# EAGLE design GD32FxxxR-dev-board (EAGLE 9.6.2)
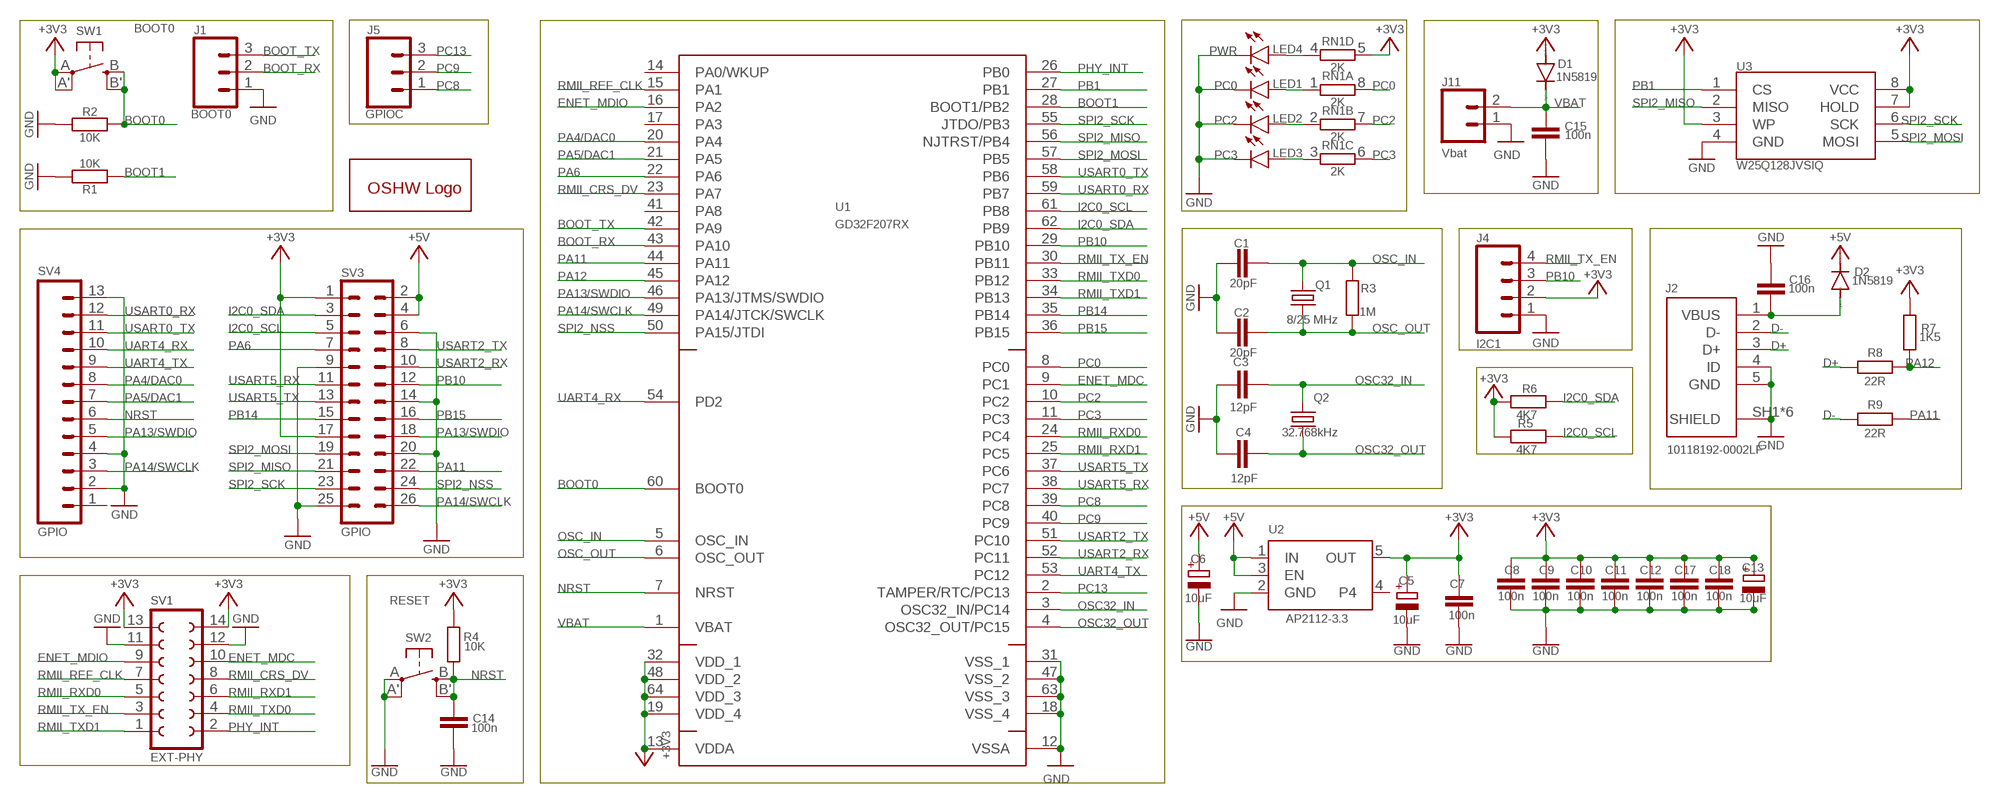
[diagram p0: schematic, sheet 1]

## Parts
C1  20pF  C-EUC0603  [C0603]
C2  20pF  C-EUC0603  [C0603]
C3  12pF  C-EUC0603  [C0603]
C4  12pF  C-EUC0603  [C0603]
C5  10uF  CPOL-EUA/3216-18R  [A/3216-18R]
C6  10uF  CPOL-EUA/3216-18R  [A/3216-18R]
C7  100n  C-EUC0603  [C0603]
C8  100n  C-EUC0603  [C0603]
C9  100n  C-EUC0603  [C0603]
C10  100n  C-EUC0603  [C0603]
C11  100n  C-EUC0603  [C0603]
C12  100n  C-EUC0603  [C0603]
C13  10uF  CPOL-EUA/3216-18R  [A/3216-18R]
C14  100n  C-EUC0603  [C0603]
C15  100n  C-EUC0603  [C0603]
C16  100n  C-EUC0603  [C0603]
C17  100n  C-EUC0603  [C0603]
C18  100n  C-EUC0603  [C0603]
D1  1N5819  DIODE-SOD323-R  [SOD323-R]
D2  1N5819  DIODE-SOD323-R  [SOD323-R]
GOLD_ORB_SM1  OSHWLOGOLOGO5MM  [OSHW_5MM]
J1  BOOT0  CONN_03  [1X03]
J2  10118192-0002LF  [10118192-0002LF]
J4  I2C1  CONN_04  [1X04]
J5  GPIOC  CONN_03  [1X03]
J11  Vbat  CONN_021X02_NO_SILK  [1X02_NO_SILK]
LED1  PC0  LEDCHIP-LED0603  [CHIP-LED0603]
LED2  PC2  LEDCHIP-LED0603  [CHIP-LED0603]
LED3  PC3  LEDCHIP-LED0603  [CHIP-LED0603]
LED4  PWR  LEDCHIP-LED0603  [CHIP-LED0603]
Q1  8/25 MHz  CSM-7X-DU  [CSM-7X-DU]
Q2  32.768kHz  KX-327-NHT  [3.2X1.5]
R1  10K  R-EU_R0603  [R0603]
R2  10K  R-EU_R0603  [R0603]
R3  1M  R-EU_R0603  [R0603]
R4  10K  R-EU_R0603  [R0603]
R5  4K7  R-EU_R0603  [R0603]
R6  4K7  R-EU_R0603  [R0603]
R7  1K5  R-EU_R0603  [R0603]
R8  22R  R-EU_R0603  [R0603]
R9  22R  R-EU_R0603  [R0603]
RN1  2K  4R-N0402ARV341  [4X0402ARV341]
SV1  EXT-PHY  FE07-2W  [FE07-2W]
SV3  GPIO  MA13-2  [MA13-2]
SV4  GPIO  CONN_13  [1X13]
SW1  BOOT0  SPST_TACT-EVQQ2  [EVQ-Q2]
SW2  RESET  SPST_TACT-EVQQ2  [EVQ-Q2]
U1  GD32F207RX  [LQFP64]
U2  AP2112-3.3  VREG_SOT23-5  [SOT23-5]
U3  W25Q128JVSIQ  SPI_FLASH-X25XXSMD1  [SO08-EIAJ]

## Nets
+3V3: C5.+ C7.1 C8.1 C9.1 C10.1 C11.1 C12.1 C13.+ C17.1 C18.1 D1.A J4.2 R4.2 R5.2 R6.2 R7.2 RN1.5 SV1.13 SV1.14 SV3.1 SV3.17 SW1.A'(P1) SW1.A(P) U1.13(VDDA) U1.19(VDD_4) U1.32(VDD_1) U1.48(VDD_2) U1.64(VDD_3) U2.5(OUT) U3.3(WP) U3.7(HOLD) U3.8(VCC)
+5V: C6.+ D2.C SV3.2 SV3.4 U2.1(IN) U2.3(EN)
BOOT0: R2.2 SW1.B'(S1) SW1.B(S) U1.60(BOOT0)
BOOT1: R1.1 U1.28(BOOT1/PB2)
BOOT_RX: J1.2 U1.43(PA10)
BOOT_TX: J1.3 U1.42(PA9)
D+: J2.3(D+) R8.1
D-: J2.2(D-) R9.1
ENET_MDC: SV1.10 U1.9(PC1)
ENET_MDIO: SV1.9 U1.16(PA2)
GND: C1.1 C2.1 C3.1 C4.1 C5.- C6.- C7.2 C8.2 C9.2 C10.2 C11.2 C12.2 C13.- C14.2 C15.2 C16.1 C17.2 C18.2 J1.1 J2.4(ID) J2.5(GND) J2.SH1(SHIELD) J2.SH2(SHIELD) J2.SH3(SHIELD) J2.SH4(SHIELD) J2.SH5(SHIELD) J2.SH6(SHIELD) J4.1 J11.1 LED1.C LED2.C LED3.C LED4.C R1.2 R2.1 SV1.11 SV1.12 SV3.6 SV3.9 SV3.14 SV3.20 SV3.25 SV4.2 SV4.4 SV4.13 SW2.A'(P1) SW2.A(P) U1.12(VSSA) U1.18(VSS_4) U1.31(VSS_1) U1.47(VSS_2) U1.63(VSS_3) U2.2(GND) U3.4(GND)
I2C0_SCL: R5.1 SV3.5 U1.61(PB8)
I2C0_SDA: R6.1 SV3.3 U1.62(PB9)
N$10: LED1.A RN1.1
N$11: LED2.A RN1.2
N$25: LED3.A RN1.3
N$26: LED4.A RN1.4
NRST: C14.1 R4.1 SV4.6 SW2.B'(S1) SW2.B(S) U1.7(NRST)
OSC32_IN: C3.2 Q2.2 U1.3(OSC32_IN/PC14)
OSC32_OUT: C4.2 Q2.1 U1.4(OSC32_OUT/PC15)
OSC_IN: C1.2 Q1.2 R3.1 U1.5(OSC_IN)
OSC_OUT: C2.2 Q1.1 R3.2 U1.6(OSC_OUT)
PA4/DAC0: SV4.8 U1.20(PA4)
PA5/DAC1: SV4.7 U1.21(PA5)
PA6: SV3.7 U1.22(PA6)
PA11: R9.2 SV3.22 U1.44(PA11)
PA12: R7.1 R8.2 U1.45(PA12)
PA13/SWDIO: SV3.18 SV4.5 U1.46(PA13/JTMS/SWDIO)
PA14/SWCLK: SV3.26 SV4.3 U1.49(PA14/JTCK/SWCLK)
PB1: U1.27(PB1) U3.1(CS)
PB10: J4.3 SV3.12 U1.29(PB10)
PB14: SV3.15 U1.35(PB14)
PB15: SV3.16 U1.36(PB15)
PC0: RN1.8 U1.8(PC0)
PC2: RN1.7 U1.10(PC2)
PC3: RN1.6 U1.11(PC3)
PC8: J5.1 U1.39(PC8)
PC9: J5.2 U1.40(PC9)
PC13: J5.3 U1.2(TAMPER/RTC/PC13)
PHY_INT: SV1.2 U1.26(PB0)
RMII_CRS_DV: SV1.8 U1.23(PA7)
RMII_REF_CLK: SV1.7 U1.15(PA1)
RMII_RXD0: SV1.5 U1.24(PC4)
RMII_RXD1: SV1.6 U1.25(PC5)
RMII_TX_EN: J4.4 SV1.3 U1.30(PB11)
RMII_TXD0: SV1.4 U1.33(PB12)
RMII_TXD1: SV1.1 U1.34(PB13)
SPI2_MISO: SV3.21 U1.56(NJTRST/PB4) U3.2(MISO)
SPI2_MOSI: SV3.19 U1.57(PB5) U3.5(MOSI)
SPI2_NSS: SV3.24 U1.50(PA15/JTDI)
SPI2_SCK: SV3.23 U1.55(JTDO/PB3) U3.6(SCK)
UART4_RX: SV4.10 U1.54(PD2)
UART4_TX: SV4.9 U1.53(PC12)
USART0_RX: SV4.12 U1.59(PB7)
USART0_TX: SV4.11 U1.58(PB6)
USART2_RX: SV3.10 U1.52(PC11)
USART2_TX: SV3.8 U1.51(PC10)
USART5_RX: SV3.11 U1.38(PC7)
USART5_TX: SV3.13 U1.37(PC6)
VBAT: C15.1 D1.C J11.2 U1.1(VBAT)
VBUS: C16.2 D2.A J2.1(VBUS)
Unconnected: SV4.1 U1.14(PA0/WKUP) U1.17(PA3) U1.41(PA8) U2.4

## Library data of the parts
C1-C4 = rcl:C-EU: CAPACITOR, European symbol; JLCPCB: C38523; SPICEPREFIX: C
C5 C6 C13 = rcl:CPOL-EU: POLARIZED CAPACITOR, European symbol; JLCPCB: C7171; SPICEPREFIX: C
C7-C12 C14-C18 = rcl:C-EU: CAPACITOR, European symbol; JLCPCB: C14663; SPICEPREFIX: C
D1 D2 = diode:DIODE-: DIODE; JLCPCB: C191023
GOLD_ORB_SM1 = oshw:OSHWLOGO: The OSHW logo for PCB layout
J1 J5 = SparkFun-Connectors:CONN_03: Multi connection point. Often used as Generic Header-pin footprint for 0.1 inch spaced/style header connections On any of the 0.1 inch spaced packages, you can populate with these: Break Away Headers - Straight <https://www.sparkfun.com/products/116> (PRT-00116) Break Away Male Headers - Right Angle <https://www.sparkfun.com/products/553> (PRT-00553) Female Headers <https://www.sparkfun.com/products/115> (PRT-00115) Break Away Headers - Machine Pin <https://www.sparkfun.com/products/117> (PRT-00117) Break Away Female Headers - Swiss Machine Pin <https://www.sparkfun.com/products/743> (PRT-00743) Stackable Header - 3 Pin (Female, 0.1") <https://www.sparkfun.com/products/13875> (PRT-13875) For SCREWTERMINALS and SPRING TERMINALS visit here: Screw Terimnals on SparkFun.com <https://www.sparkfun.com/search/results?term=Screw+Terminals> (5mm/3.5mm/2.54mm spacing) This device is also useful as a general connection point to wire up your design to another part of your project. Our various solder wires solder well into these plated through hole pads. Hook-Up Wire - Assortment (Stranded, 22 AWG) <https://www.sparkfun.com/products/11375> (PRT-11375) Hook-Up Wire - Assortment (Solid Core, 22 AWG) <https://www.sparkfun.com/products/11367> (PRT-11367) View the entire wire category on our website here <https://www.sparkfun.com/categories/141> Special notes: Molex polarized connector foot print use with SKU : PRT-08232 with associated crimp pins and housings.
J2 = USB connector:10118192-0002LF: CONN RCPT USB2.0 MICRO B SMD R/A Manufacturer's datasheet <https://www.amphenol-icc.com/media/wysiwyg/files/drawing/10118192.pdf>; CREATED_BY: PCBLayout.com; DIGIKEY_PARTNO: 609-5379-2-ND; JLCPCB: C2972784; MANUFACTURER: Amphenol ICC (FCI); MPN: 10118192-0002LF
J4 = SparkFun-Connectors:CONN_04: Multi connection point. Often used as Generic Header-pin footprint for 0.1 inch spaced/style header connections On any of the 0.1 inch spaced packages, you can populate with these: Break Away Headers - Straight <https://www.sparkfun.com/products/116> (PRT-00116) Break Away Male Headers - Right Angle <https://www.sparkfun.com/products/553> (PRT-00553) Female Headers <https://www.sparkfun.com/products/115> (PRT-00115) Break Away Headers - Machine Pin <https://www.sparkfun.com/products/117> (PRT-00117) Break Away Female Headers - Swiss Machine Pin <https://www.sparkfun.com/products/743> (PRT-00743) For SCREWTERMINALS and SPRING TERMINALS visit here: Screw Terimnals on SparkFun.com <https://www.sparkfun.com/search/results?term=Screw+Terminals> (5mm/3.5mm/2.54mm spacing) This device is also useful as a general connection point to wire up your design to another part of your project. Our various solder wires solder well into these plated through hole pads. Hook-Up Wire - Assortment (Stranded, 22 AWG) <https://www.sparkfun.com/products/11375> (PRT-11375) Hook-Up Wire - Assortment (Solid Core, 22 AWG) <https://www.sparkfun.com/products/11367> (PRT-11367) View the entire wire category on our website here <https://www.sparkfun.com/categories/141> Special notes: Molex polarized connector foot print use with SKU : PRT-08231 with associated crimp pins and housings. 1MM SMD Version SKU: PRT-10208; PROD_ID: CONN-09696
J11 = SparkFun-Connectors:CONN_02: Multi connection point. Often used as Generic Header-pin footprint for 0.1 inch spaced/style header connections On any of the 0.1 inch spaced packages, you can populate with these: Break Away Headers - Straight <https://www.sparkfun.com/products/116> (PRT-00116) Break Away Male Headers - Right Angle <https://www.sparkfun.com/products/553> (PRT-00553) Female Headers <https://www.sparkfun.com/products/115> (PRT-00115) Break Away Headers - Machine Pin <https://www.sparkfun.com/products/117> (PRT-00117) Break Away Female Headers - Swiss Machine Pin <https://www.sparkfun.com/products/743> (PRT-00743) For SCREWTERMINALS and SPRING TERMINALS visit here: Screw Terimnals on SparkFun.com <https://www.sparkfun.com/search/results?term=Screw+Terminals> (5mm/3.5mm/2.54mm spacing) This device is also useful as a general connection point to wire up your design to another part of your project. Our various solder wires solder well into these plated through hole pads. Hook-Up Wire - Assortment (Stranded, 22 AWG) <https://www.sparkfun.com/products/11375> (PRT-11375) Hook-Up Wire - Assortment (Solid Core, 22 AWG) <https://www.sparkfun.com/products/11367> (PRT-11367) View the entire wire category on our website here <https://www.sparkfun.com/categories/141> Special notes: Molex polarized connector foot print use with: PRT-08233 with associated crimp pins and housings. 2.54_SCREWTERM for use with PRT-10571. 3.5mm Screw Terminal footprints for PRT-08084 5mm Screw Terminal footprints for use with PRT-08432
LED1-LED4 = led:LED: LED OSRAM: - CHIPLED LG R971, LG N971, LY N971, LG Q971, LY Q971, LO R971, LY R971 LH N974, LH R974 LS Q976, LO Q976, LY Q976 LO Q996 - Hyper CHIPLED LW Q18S LB Q993, LB Q99A, LB R99A - SideLED LS A670, LO A670, LY A670, LG A670, LP A670 LB A673, LV A673, LT A673, LW A673 LH A674 LY A675 LS A676, LA A676, LO A676, LY A676, LW A676 LS A679, LY A679, LG A679 - Hyper Micro SIDELED® LS Y876, LA Y876, LO Y876, LY Y876 LT Y87S - SmartLED LW L88C, LW L88S LB L89C, LB L89S, LG L890 LS L89K, LO L89K, LY L89K LS L896, LA L896, LO L896, LY L896 - TOPLED LS T670, LO T670, LY T670, LG T670, LP T670 LSG T670, LSP T670, LSY T670, LOP T670, LYG T670 LG T671, LOG T671, LSG T671 LB T673, LV T673, LT T673, LW T673 LH T674 LS T676, LA T676, LO T676, LY T676, LB T676, LH T676, LSB T676, LW T676 LB T67C, LV T67C, LT T67C, LS T67K, LO T67K, LY T67K, LW E67C LS E67B, LA E67B, LO E67B, LY E67B, LB E67C, LV E67C, LT E67C LW T67C LS T679, LY T679, LG T679 LS T770, LO T770, LY T770, LG T770, LP T770 LB T773, LV T773, LT T773, LW T773 LH T774 LS E675, LA E675, LY E675, LS T675 LS T776, LA T776, LO T776, LY T776, LB T776 LHGB T686 LT T68C, LB T68C - Hyper Mini TOPLED® LB M676 - Mini TOPLED Santana® LG M470 LS M47K, LO M47K, LY M47K Source: http://www.osram.convergy.de LUXEON: - LUMILED® LXK2-PW12-R00, LXK2-PW12-S00, LXK2-PW14-U00, LXK2-PW14-V00 LXK2-PM12-R00, LXK2-PM12-S00, LXK2-PM14-U00 LXK2-PE12-Q00, LXK2-PE12-R00, LXK2-PE12-S00, LXK2-PE14-T00, LXK2-PE14-U00 LXK2-PB12-K00, LXK2-PB12-L00, LXK2-PB12-M00, LXK2-PB14-N00, LXK2-PB14-P00, LXK2-PB14-Q00 LXK2-PR12-L00, LXK2-PR12-M00, LXK2-PR14-Q00, LXK2-PR14-R00 LXK2-PD12-Q00, LXK2-PD12-R00, LXK2-PD12-S00 LXK2-PH12-R00, LXK2-PH12-S00 LXK2-PL12-P00, LXK2-PL12-Q00, LXK2-PL12-R00 Source: www.luxeon.com KINGBRIGHT: KA-3528ASYC Source: www.kingbright.com
Q1 = crystal:CSM-7X-DU: SMD CRYSTAL Source: www.ecsxtal.com .. Crystal 3.6864MHz CSM_7X_DU.PDF; OC_FARNELL: unknown; OC_NEWARK: unknown
Q2 = crystal-geyer_V1_0:KX-327: Tuning Fork Crystals (kHz) SMD: KX327 - Serie Model Size l/w/h [mm] Frequency Range Frequency Stability Temp. Range [°C] Load Capacitance AECQ 200 availabel Datasheet KX-327VT KX-327FT KX-327RT KX-327NHT KX-327NHF KX-327L KX-327S 1.25/1.05/0.5 1.6/1.0/0.5 2.0/1.2/0.6 3.2/1.5/0.8 3.2/1.5/0.8 7.0/1.5/1.4 8.2/3.8/2.5 32,768 kHz 32,768 kHz 32,768 kHz 32,768 kHz 32,768 kHz 32,768 kHz 32,768 kHz ±10 … ±20ppm ±10 … ±20ppm ±10 … ±20ppm ±10 … ±20ppm ±10 … ±20ppm ±10 … ±20ppm ±5 … ±20ppm (*) -40°C …+85°C (*) -40°C …+85°C (*) -40°C …+85°C (*) -40°C …+85°C (*) -40°C …+125°C (*) -40°C …+85°C (*) -40°C …+85°C 7/9/12,5 7/9/12,5 7/9/12,6 7/9/12,5 9/12,5 7/9/12,5 6/12,5 - - - - yes - - KX-327VT.pdf <http://www.geyer-electronic.de/uploads/tx_userartikelfrequenz/GEYER-KX-327VT.pdf> KX-327FT.pdf <http://www.geyer-electronic.de/uploads/tx_userartikelfrequenz/GEYER-KX-327FT.pdf> KX-327RT.pdf <http://www.geyer-electronic.de/uploads/tx_userartikelfrequenz/GEYER-KX-327RT.pdf> KX-327NHT.pdf <http://www.geyer-electronic.de/uploads/tx_userartikelfrequenz/GEYER-KX-327NHT.pdf> KX-327NHF.pdf <http://www.geyer-electronic.de/uploads/tx_userartikelfrequenz/GEYER-KX-327NHF.pdf> KX-327L.pdf <http://www.geyer-electronic.de/uploads/tx_userartikelfrequenz/GEYER-KX-327L.pdf> KX-327S.pdf <http://www.geyer-electronic.de/uploads/tx_userartikelfrequenz/GEYER-KX-327S.pdf> <http://www.geyer-electronic.de/fileadmin/template/img/logo-geyer-electronic.png> Details see: http://www.geyer-electronic.de/Frequenz-Produkte.9.0.html Created 2016-06-07, Hans Locher 2016 (C) Geyer Quartz Technology KX327VT,KX327FT,KX327RT,KX327NHT,KX327NHF,KX327S,KX327L;125105;1610;2012;3215;7015;8238;1,25x1,05,1.25x1.05;1,6x1,0,1.6x1.0;2,0x1,2,2.0x1.2;3,2x1,5,3.2x1.5;8,2x3,8,8.2x3.8,7.0x1.5,7,0x1,532.768kHz; JLCPCB: 32.768kHz
R1 R2 R4 = rcl:R-EU_: RESISTOR, European symbol; JLCPCB: C25804; SPICEPREFIX: R
R3 = rcl:R-EU_: RESISTOR, European symbol; JLCPCB: C22935; SPICEPREFIX: R
R5 R6 = rcl:R-EU_: RESISTOR, European symbol; JLCPCB: C23162; SPICEPREFIX: R
R7 = rcl:R-EU_: RESISTOR, European symbol; JLCPCB: C4190; SPICEPREFIX: R
R8 R9 = rcl:R-EU_: RESISTOR, European symbol; JLCPCB: C23345; SPICEPREFIX: R
RN1 = resistor-dil:4R-N: Array Chip Resistor Source: RS Component / Phycomp; JLCPCB: C44891; OC_FARNELL: unknown; OC_NEWARK: unknown
SV1 = con-lsta:FE07-2W: FEMALE HEADER; OC_FARNELL: unknown; OC_NEWARK: unknown
SV3 = con-lstb:MA13-2: PIN HEADER; OC_FARNELL: unknown; OC_NEWARK: unknown
SV4 = SparkFun-Connectors:CONN_13: Multi connection point. Often used as Generic Header-pin footprint for 0.1 inch spaced/style header connections On any of the 0.1 inch spaced packages, you can populate with these: Break Away Headers - Straight <https://www.sparkfun.com/products/116> (PRT-00116) Break Away Male Headers - Right Angle <https://www.sparkfun.com/products/553> (PRT-00553) Female Headers <https://www.sparkfun.com/products/115> (PRT-00115) Break Away Headers - Machine Pin <https://www.sparkfun.com/products/117> (PRT-00117) Break Away Female Headers - Swiss Machine Pin <https://www.sparkfun.com/products/743> (PRT-00743) For SCREWTERMINALS and SPRING TERMINALS visit here: Screw Terimnals on SparkFun.com <https://www.sparkfun.com/search/results?term=Screw+Terminals> (5mm/3.5mm/2.54mm spacing) This device is also useful as a general connection point to wire up your design to another part of your project. Our various solder wires solder well into these plated through hole pads. Hook-Up Wire - Assortment (Stranded, 22 AWG) <https://www.sparkfun.com/products/11375> (PRT-11375) Hook-Up Wire - Assortment (Solid Core, 22 AWG) <https://www.sparkfun.com/products/11367> (PRT-11367) View the entire wire category on our website here <https://www.sparkfun.com/categories/141> Special notes: Molex polarized connector foot print use with SKU : PRT-08231 with associated crimp pins and housings. 1MM SMD Version SKU: PRT-10208 NOTES ON THE VARIANTS LOCK and LOCK_LONGPADS... This footprint was designed to help hold the alignment of a through-hole component (i.e. 6-pin header) while soldering it into place. You may notice that each hole has been shifted either up or down by 0.005 of an inch from it's more standard position (which is a perfectly straight line). This slight alteration caused the pins (the squares in the middle) to touch the edges of the holes. Because they are alternating, it causes a "brace" to hold the component in place. 0.005 has proven to be the perfect amount of "off-center" position when using our standard breakaway headers. Although looks a little odd when you look at the bare footprint, once you have a header in there, the alteration is very hard to notice. Also,if you push a header all the way into place, it is covered up entirely on the bottom side.
SW1 = adafruit:SPST_TACT: SMT 6mm switch, EVQQ2 series http://www.ladyada.net/library/eagle; JLCPCB: C221880
SW2 = adafruit:SPST_TACT: SMT 6mm switch, EVQQ2 series http://www.ladyada.net/library/eagle
U1 = GD3F207Rx:GD32F207RX: The GD32F207xx device belongs to the performance line of GD32 MCU Family.; DATASHEET: http://www.gd32mcu.com/en/download/0?kw=GD32F2; SUPPLIER: GigaDevice
U2 = microbuilder:VREG_SOT23-5: SOT23-5 Fixed Voltage Regulators Part Current Out V Out V In V Dropout θJA (°C/W) TJ (°C) Digikey Part No. ADP121 150mA 3.3V 3.4-5.5V 0.09V @ 150mA -- -- ADP121-AUJZ33R7CT-ND ADP121 150mA 3.0V 3.1-5.5V 0.09V @ 150mA -- -- ADP121-AUJZ30R7CT-ND ADP122 300mA 3.3V 3.4-5.5V 0.085V @ 300mA -- -- ADP122AUJZ-3.3-R7CT-ND ADP1712 300mA 3.3V 3.5-5.5V 0.17V @ 300mA -- -- ADP1712AUJZ-3.3-R7TR-ND AP7311 (Low Cost) 150mA 3.3V 3.5-6V 0.15V @ 150mA -- -- AP7311-33WG-7DICT-ND LD39015M18R 150mA 1.8V 1.9V-5.5V 0.08V @ 100mA -- -- 497-6977-1-ND LP2985A-33DBVR 150mA 3.3V 3.3-16V 0.28V @ 150mA 206 150 296-18479-1-ND MCP1824T-3302E/OT 300mA 3.3V 3.5V-6V 0.2V @ 300mA -- -- MCP1824T-3302E/OTCT-ND MIC5205-2.5YM5 TR 150mA 2.5V 2.7-16V 0.165V @ 150mA -- -- 576-1257-2-ND MIC5205-3.0YM5 TR 150mA 3.0V 3.2V-16V 0.165V @ 150mA -- -- 576-1258-2-ND MIC5205-3.3YM5 TR 150mA 3.3V 3.5V-16V 0.165V @ 150mA -- -- 576-1259-2-ND TPS780330220 150mA 3.3V+2.2V 3.6-5.5V 250mV Max -- -- 296-23332-1-ND TDA3663/N1,135 100mA 3.3V 3.5-45V 0.18V @ 50mA -- -- 568-5343-1-ND Max operating temp can be calculated using θJA, TJ (max junction temperature), and power in watts. Set the "Maximum Ambient Temperature" until it reaches TJ ("Max Junction Temperature"), which is the absolute limit for safe use of the regulator: Heat Sink Temperature Calculator <http://www.daycounter.com/Calculators/Heat-Sink-Temperature-Calculator.phtml> For example, With 12V source into a 3.3V LP2985 and a 30mA load, we are dissipating (12V-3.3V) * 0.03A = 0.261W. With a θJA of 206 °C/W, a TJ of 150°C, and 261mW we can safely use the chip without a heat sink up to 75°C (=147.1°C Junction Temperature).; JLCPCB: C51118
U3 = SparkFun-IC-Memory:SPI_FLASH-X25XX: 32M Serial Flash Memory 8pin SPI Flash series x25xx. Works with devices like W25X32 and BR25L32 Datasheet <http://www.macronix.com/Lists/Datasheet/Attachments/5031/MX25L3206E,%203V,%2032Mb,%20v1.5.pdf> SparkFun Products SparkFun Venus GPS Logger <https://www.sparkfun.com/products/10920> (GPS-10920); JLCPCB: C97521; PROD_ID: IC-09109; VALUE: 25F32006WSOI

## Board
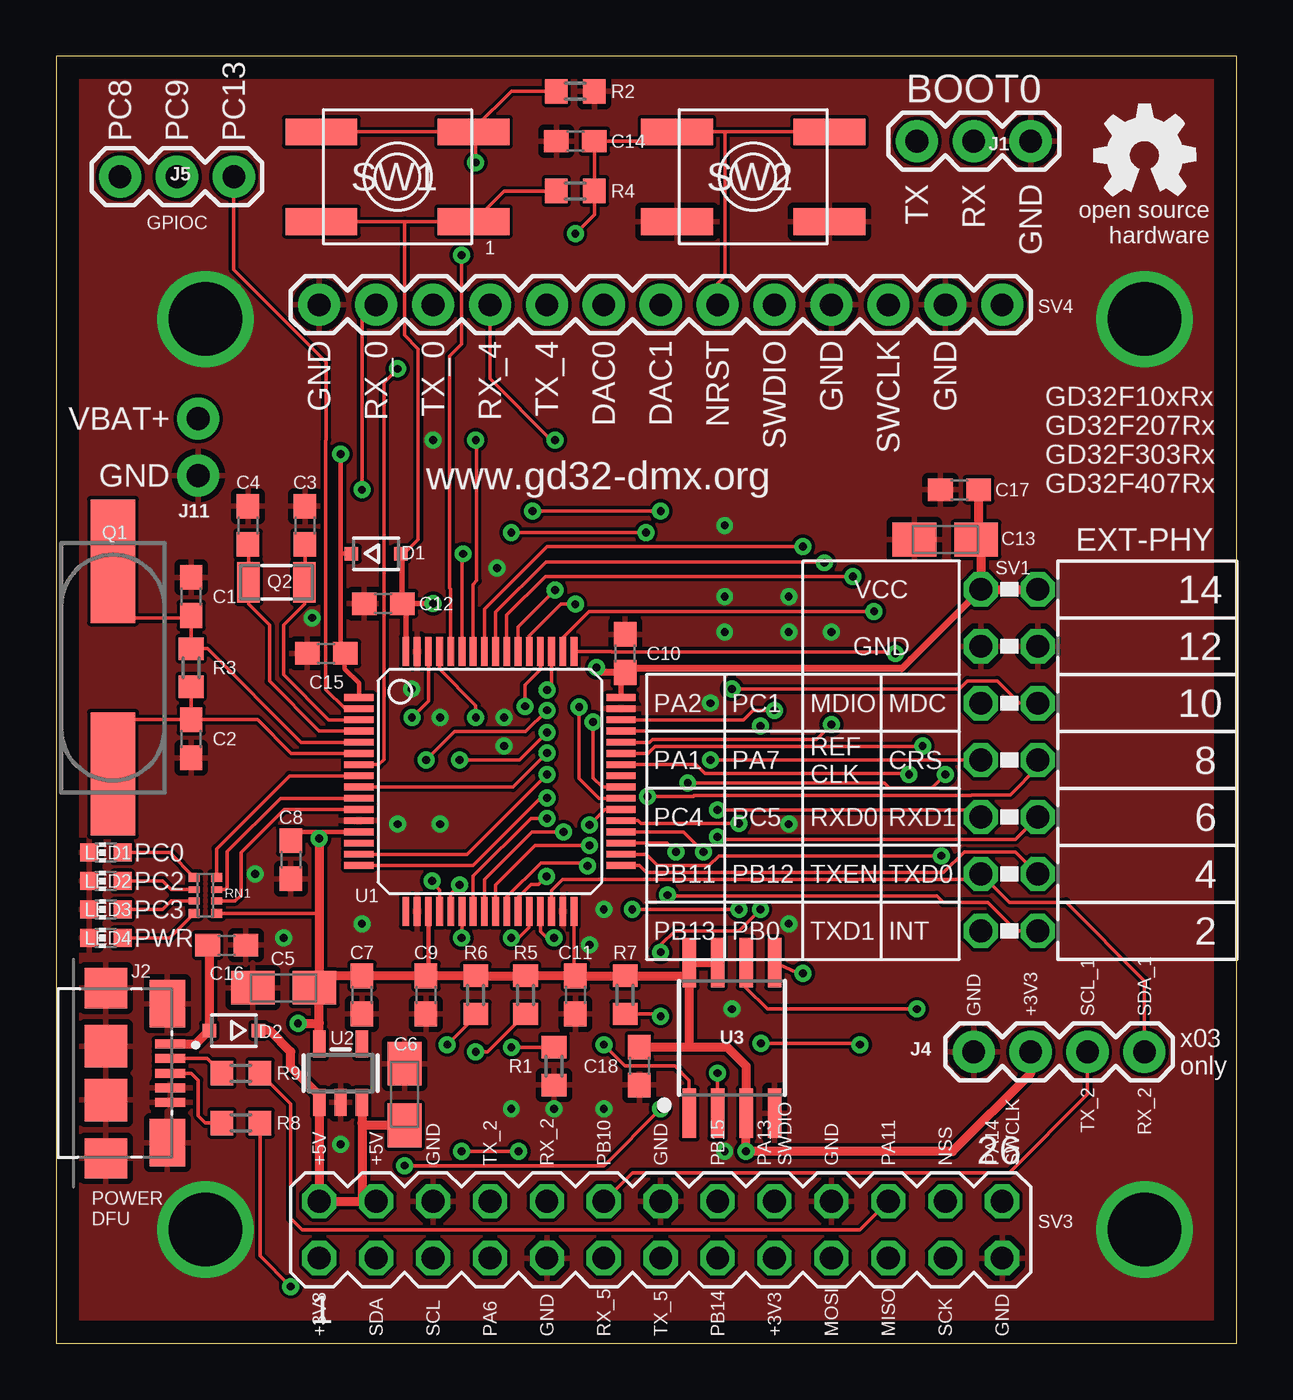
[diagram p1: board, top side]
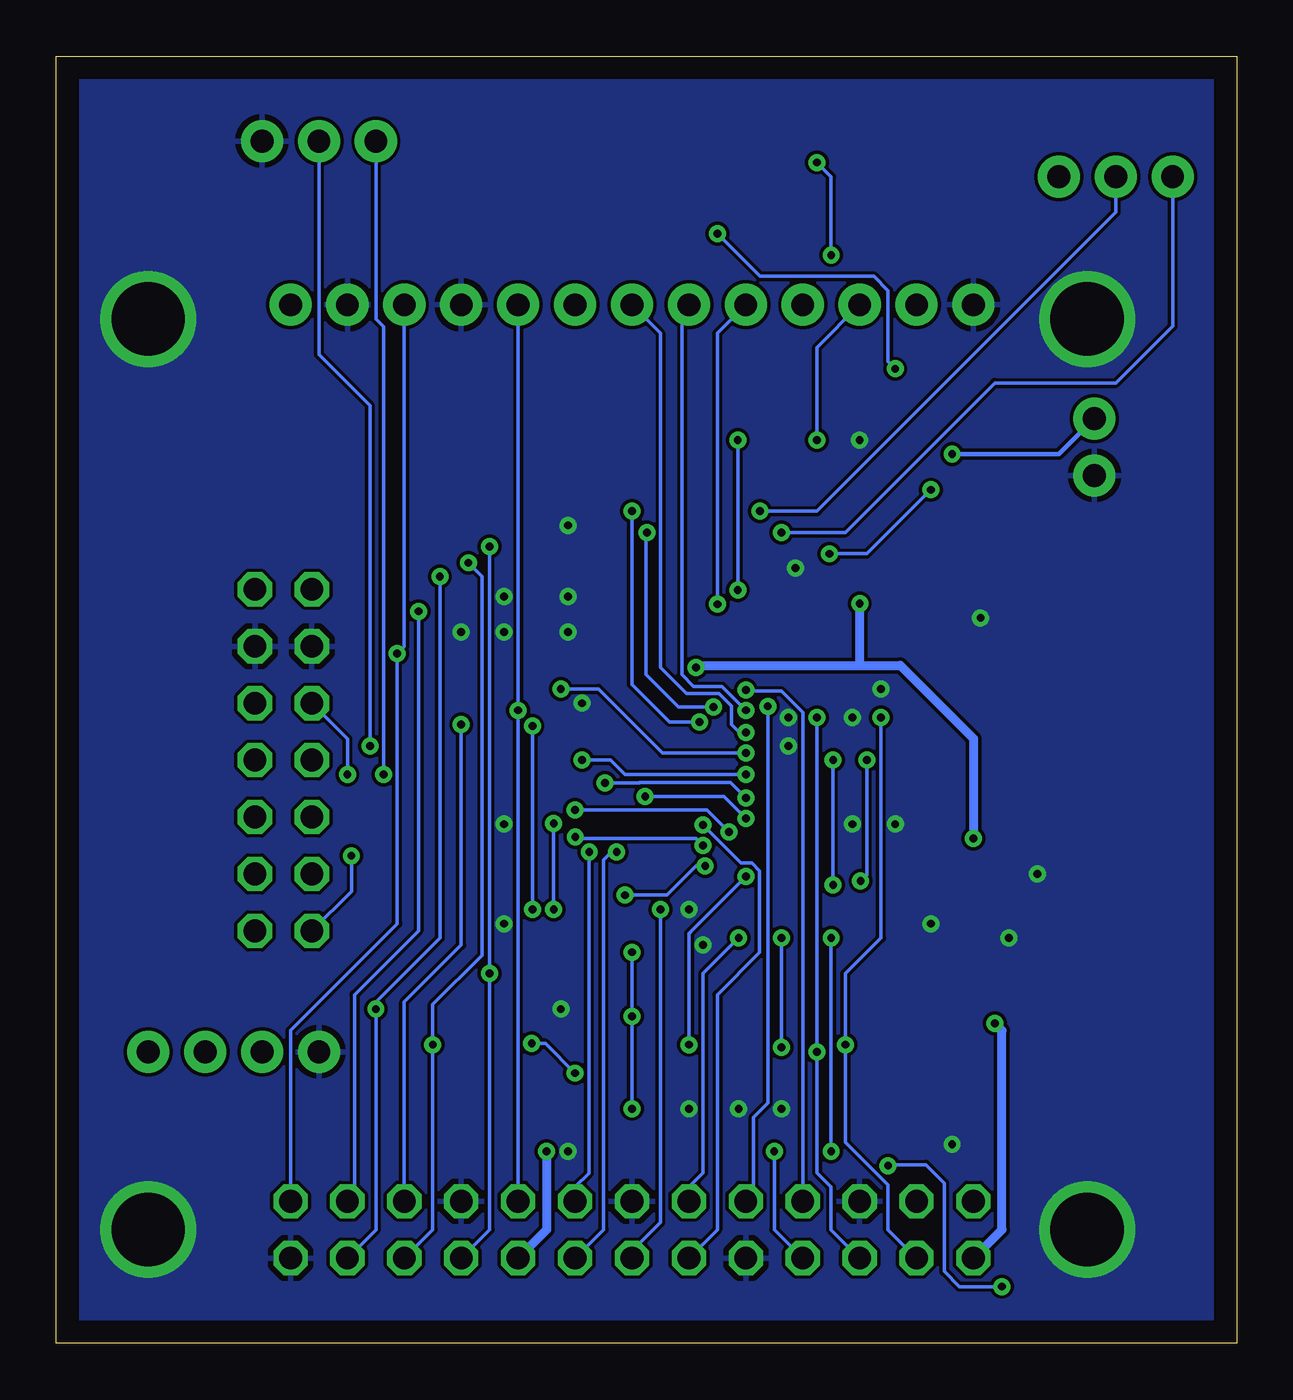
[diagram p2: board, bottom side, seen from below]

Size 52.69 x 57.46 mm. Coordinates in mm from the lower left corner, seen from the top.
Outline: 0,0 52.69,0 52.69,57.46 0,57.46 0,0
Copper layers (1*16): Top 0.035mm / dielectric 1.5mm / Bottom 0.035mm
Design rules "default": minimum track width 6mil, minimum drill 0.35mm, track to track 6mil, track to pad 6mil, pad to pad 6mil, via to via 6mil, smd to smd 6mil, copper to edge 40mil, drill to drill 6mil, minimum pad ring 10mil, minimum via ring 8mil, stop-mask expansion 4mil, vias tented up to drill 0mil, thermal gap 10mil

### Footprints (pad centres in the part's own frame; a part is rotated, then mirrored left to right if it is on the bottom)
C0603 = smd 1.1 x 1: 1 -0.85,0; 2 0.85,0
A/3216-18R = smd 1.95 x 1.5: + 1.375,0; - -1.375,0
SOD323-R = smd 0.6 x 0.6: A 1.1,0; C -1.1,0
1X03 = drill 1.016 pad 1.88: 1 0,0; 2 2.54,0; 3 5.08,0
10118192-0002LF = smd 0.4 x 1.35: 1 -1.3,2.875; 2 -0.65,2.875; 3 0,2.875; 4 0.65,2.875; 5 1.3,2.875 | smd 2.1 x 1.6: SH1 -3.1,2.75; SH2 3.1,2.75 | smd 1.8 x 1.9: SH3 -3.8,0; SH4 3.8,0 | smd 1.9 x 1.9: SH5 -1.2,0; SH6 1.2,0
1X04 = drill 1.016 pad 1.88: 1 0,0; 2 2.54,0; 3 5.08,0; 4 7.62,0
1X02_NO_SILK = drill 1.016 pad 1.88: 1 0,0; 2 2.54,0
CHIP-LED0603 = smd 0.8 x 0.8: A 0,-0.75; C 0,0.75
CSM-7X-DU = smd 5.5 x 2: 1 -4.75,0; 2 4.75,0
3.2X1.5 = smd 1 x 1.8: 1 -1.25,0; 2 1.25,0
R0603 = smd 1 x 1.1: 1 -0.85,0; 2 0.85,0
4X0402ARV341 = smd 0.4 x 0.5: 1 -0.8,-0.5; 4 0.8,-0.5; 5 0.8,0.5; 8 -0.8,0.5 | smd 0.3 x 0.5: 2 -0.25,-0.5; 3 0.25,-0.5; 6 0.25,0.5; 7 -0.25,0.5
FE07-2W = drill 1.016 octagon: 1 -7.62,1.27; 2 -7.62,-1.27; 3 -5.08,1.27; 4 -5.08,-1.27; 5 -2.54,1.27; 6 -2.54,-1.27; 7 0,1.27; 8 0,-1.27; 9 2.54,1.27; 10 2.54,-1.27; 11 5.08,1.27; 12 5.08,-1.27; 13 7.62,1.27; 14 7.62,-1.27
MA13-2 = drill 1.016 octagon: 1 -15.24,-1.27; 2 -15.24,1.27; 3 -12.7,-1.27; 4 -12.7,1.27; 5 -10.16,-1.27; 6 -10.16,1.27; 7 -7.62,-1.27; 8 -7.62,1.27; 9 -5.08,-1.27; 10 -5.08,1.27; 11 -2.54,-1.27; 12 -2.54,1.27; 13 0,-1.27; 14 0,1.27; 15 2.54,-1.27; 16 2.54,1.27; 17 5.08,-1.27; 18 5.08,1.27; 19 7.62,-1.27; 20 7.62,1.27; 21 10.16,-1.27; 22 10.16,1.27; 23 12.7,-1.27; 24 12.7,1.27; 25 15.24,-1.27; 26 15.24,1.27
1X13 = drill 1.016 pad 1.88: 1 0,0; 2 2.54,0; 3 5.08,0; 4 7.62,0; 5 10.16,0; 6 12.7,0; 7 15.24,0; 8 17.78,0; 9 20.32,0; 10 22.86,0; 11 25.4,0; 12 27.94,0; 13 30.48,0
EVQ-Q2 = smd 3.2 x 1.2: A -3.4,-2; A' 3.4,-2; B -3.4,2; B' 3.4,2
LQFP64 = smd 1.3 x 0.3: 1 -5.85,3.75; 2 -5.85,3.25; 3 -5.85,2.75; 4 -5.85,2.25; 5 -5.85,1.75; 6 -5.85,1.25; 7 -5.85,0.75; 8 -5.85,0.25; 9 -5.85,-0.25; 10 -5.85,-0.75; 11 -5.85,-1.25; 12 -5.85,-1.75; 13 -5.85,-2.25; 14 -5.85,-2.75; 15 -5.85,-3.25; 16 -5.85,-3.75; 33 5.85,-3.75; 34 5.85,-3.25; 35 5.85,-2.75; 36 5.85,-2.25; 37 5.85,-1.75; 38 5.85,-1.25; 39 5.85,-0.75; 40 5.85,-0.25; 41 5.85,0.25; 42 5.85,0.75; 43 5.85,1.25; 44 5.85,1.75; 45 5.85,2.25; 46 5.85,2.75; 47 5.85,3.25; 48 5.85,3.75 | smd 0.3 x 1.3: 17 -3.75,-5.8; 18 -3.25,-5.8; 19 -2.75,-5.8; 20 -2.25,-5.8; 21 -1.75,-5.8; 22 -1.25,-5.8; 23 -0.75,-5.8; 24 -0.25,-5.8; 25 0.25,-5.8; 26 0.75,-5.8; 27 1.25,-5.8; 28 1.75,-5.8; 29 2.25,-5.8; 30 2.75,-5.8; 31 3.25,-5.8; 32 3.75,-5.8; 49 3.75,5.8; 50 3.25,5.8; 51 2.75,5.8; 52 2.25,5.8; 53 1.75,5.8; 54 1.25,5.8; 55 0.75,5.8; 56 0.25,5.8; 57 -0.25,5.8; 58 -0.75,5.8; 59 -1.25,5.8; 60 -1.75,5.8; 61 -2.25,5.8; 62 -2.75,5.8; 63 -3.25,5.8; 64 -3.75,5.8
SOT23-5 = smd 0.55 x 1.2: 1 -0.95,-1.3; 2 0,-1.3; 3 0.95,-1.3; 4 0.95,1.3; 5 -0.95,1.3
SO08-EIAJ = smd 0.61 x 2.21: 1 -1.905,-3.378; 2 -0.635,-3.378; 3 0.635,-3.378; 4 1.905,-3.378; 5 1.905,3.353; 6 0.635,3.353; 7 -0.635,3.353; 8 -1.905,3.353

### Placement (x,y rotation side)
C1  6.03,33.34 270 top
C2  6.03,26.99 90 top
C3  11.11,36.51 270 top
C4  8.57,36.51 270 top
C5  10.16,15.88 0 top
C6  15.56,11.11 270 top
C7  13.65,15.56 270 top
C8  10.48,21.59 270 top
C9  16.51,15.56 270 top
C10  25.4,30.8 90 top
C11  23.18,15.56 270 top
C12  14.61,33.02 180 top
C13  39.69,35.88 0 top
C14  23.18,53.66 180 top
C15  12.06,30.8 180 top
C16  7.62,17.78 180 top
C17  40.32,38.1 180 top
C18  26.04,12.38 270 top
D1  14.29,35.24 0 top
D2  7.94,13.97 180 top
GOLD_ORB_SM1  48.58,53.02 0 top
J1  43.5,53.66 180 top
J2  2.22,12.06 270 top
J4  40.96,13.02 0 top
J5  2.86,52.07 0 top
J11  6.35,38.73 90 top
LED1  2.22,21.91 90 top
LED2  2.22,20.64 90 top
LED3  2.22,19.37 90 top
LED4  2.22,18.1 90 top
Q1  2.54,30.16 90 top
Q2  9.84,33.97 0 top
R1  22.23,12.38 270 top
R2  23.18,55.88 180 top
R3  6.03,30.16 270 top
R4  23.18,51.44 180 top
R5  20.95,15.56 90 top
R6  18.73,15.56 90 top
R7  25.4,15.56 90 top
R8  8.26,9.84 0 top
R9  8.26,12.06 0 top
RN1  6.67,20 270 top
SV1  42.55,26.04 90 top
SV3  26.99,5.08 0 top
SV4  42.23,46.35 180 top
SW1  15.24,52.07 0 top
SW2  31.11,52.07 0 top
U1  19.37,25.08 0 top
U2  12.7,12.06 0 top
U3  30.16,13.65 0 top

### Tracks (layer width: path | path; a pad name or v marks a point on that pad's centre or on a via)
+3V3  (via drill 0.35)
  Top 0.152: 25.22,29.77 C10.1 | SW1.A 15.56,50.07 | 15.56,50.07 SW1.A' 20,51.44 R4.2 | 10.87,22.83 C8.1 | U1.32 23.12,16.47 C11.1 | 15.56,50.07 15.56,44.99 16.16,44.38 16.16,35.88 15.46,35.17 | RN1.5 11.58,19.2 11.75,19.37
  Top 0.203: U1.19 16.62,16.52 C9.1 | U1.13 11.75,22.83 | 11.75,22.83 10.87,22.83 | v11.75,22.54 11.75,22.83
  Top 0.254: 25.22,30 25.39,30.16 | U1.48 25.22,29.77 | U1.64 15.62,32.86 C12.1 | C12.1 15.46,35.17 D1.A | v16.82,33.02 C12.1
  Top 0.305: 25.39,30.16 C10.1 24.34,29.95 v24.13,30.16 | 25.22,30 25.34,30.11 37.75,30.11 38.15,30.52 38.15,30.53 SV1.13
  Top 0.406: C17.1 41.17,35.99 C13.+ 41.27,35.66 SV1.13 SV1.14 | U3.7 U3.8 28.26,16.51 | J4.2 43.5,12.06 40.01,8.57 v30.8,8.57 U3.3 30.8,12.38 29.95,13.23 28.26,13.23 | C18.1 28.26,13.23 | 28.26,16.51 28.26,13.23 | 28.26,16.51 28.16,16.41 R7.2 C11.1 R5.2 R6.2 16.73,16.41 16.62,16.52 | C9.1 C7.1 12.07,16.41 11.75,16.09 | v11.75,22.54 11.75,19.37 11.75,16.09 | 11.75,16.09 C5.+ 11.75,15.88 11.75,14.29 | U2.5 11.75,14.29 | v10.8,14.29 11.75,14.29
  Bottom 0.406: v11.75,22.54 11.75,27 15.01,30.26 16.83,30.26 | v24.13,30.16 24.03,30.26 16.83,30.26 | v16.82,33.02 v16.83,33.02 16.83,30.26 | v30.8,8.57 30.8,5.08 SV3.17 | SV3.1 10.48,5.08 10.48,13.97 v10.8,14.29
+5V
  Top 0.406: 13.65,6.35 SV3.2 U2.1 11.75,11.08 10.48,12.36 10.48,13.02 9.53,13.97 D2.C | 13.65,6.35 SV3.4 | U2.3 13.65,9.84 | 13.65,9.84 13.65,6.35 | C6.+ 13.76,9.74 13.65,9.84
BOOT0  (via drill 0.35)
  Top 0.152: SW1.B SW1.B' 18.73,53.98 | v18.73,52.7 18.73,53.98 | R2.2 20.32,55.88 18.73,54.29 18.73,53.98 | v18.1,48.58 18.1,44.6 17.57,44.07 17.57,33.72 17.62,33.67 U1.60
  Bottom 0.152: v18.1,48.58 18.1,52.07 v18.73,52.7
BOOT1  (via drill 0.35)
  Top 0.152: R1.1 22.21,13.21 v20.32,13.21 | U1.28 21.12,18.58 20.64,18.1 v20.32,18.1
  Bottom 0.152: v20.32,13.21 v20.32,18.1
BOOT_RX  (via drill 0.35)
  Top 0.152: U1.43 26.43,26.33 26.74,26.64 38.65,26.64 v38.68,26.67
  Bottom 0.152: v38.68,26.67 38.68,41.85 40.96,44.13 J1.2
BOOT_TX  (via drill 0.35)
  Top 0.152: U1.42 28.55,25.83 28.96,25.43 38.04,25.43 v38.07,25.4
  Bottom 0.152: v38.07,25.4 38.07,45.37 38.42,45.72 J1.3
D+
  Top 0.152: R8.1 6.67,9.84 6.35,10.16 6.35,11.75 6.03,12.06 J2.3
D-
  Top 0.152: J2.2 6.75,12.71 R9.1
ENET_MDC  (via drill 0.35)
  Top 0.152: SV1.10 42.99,28.57 42,29.57 40.68,29.57 40.32,29.21 v30.16,29.21 | v21.91,26.35 20.39,24.83 U1.9
  Bottom 0.152: v30.16,29.21 28.48,29.21 25.63,26.35 v21.91,26.35
ENET_MDIO  (via drill 0.35)
  Top 0.152: v28.19,25.02 36.96,25.02 37.19,24.79 39.08,24.79 v39.69,25.4 | v21.91,24.35 21.62,24.35 18.61,21.33 U1.16
  Bottom 0.152: v39.69,25.4 39.69,26.99 SV1.9 | v28.19,25.02 26.66,25.02 26.65,25.03 22.59,25.03 v21.91,24.35
GND  (via drill 0.35, 3.28)
  other vias: 6.67,5.08 48.58,5.08 6.67,45.72 48.58,45.72 29.21,28.57 32.7,23.18 16.83,40.32 34.61,31.75 29.84,36.51 32.7,33.34 32.7,31.75 15.24,23.18 17.14,23.18 17.14,27.94 15.88,29.21 20,27.94 32.7,18.73 20,26.67 24.45,19.37 29.84,33.34 29.84,31.75 20.32,10.48 24.45,10.48 22.23,10.48 19.68,34.61 30.16,14.92 23.81,17.78 8.89,20.95 10.16,18.1 13.65,18.73 29.84,8.57 12.7,8.89 11.43,32.38
  pour Top: -0.95,58.42 -0.95,-1.27 53.98,-1.27 53.98,58.42
  pour Bottom: -0.95,58.42 -0.95,-1.27 53.98,-1.27 53.98,58.42
I2C0_SCL  (via drill 0.35)
  Top 0.152: U1.61 17.12,30.1 18.73,28.48 v18.73,27.94 | v18.73,13.02 19.27,13.02 R5.1
  Bottom 0.152: v18.73,27.94 v18.73,13.02 18.73,7.62 18.1,6.99 18.1,5.08 SV3.5
I2C0_SDA  (via drill 0.35)
  Top 0.152: v15.88,27.93 16.62,28.67 U1.62 | v17.46,13.34 18.73,14.61 R6.1
  Bottom 0.152: SV3.3 15.56,5.08 15.56,7.08 17.46,8.98 v17.46,13.34 17.46,16.51 15.88,18.1 v15.88,27.94 v15.88,27.93
N$10
  Top 0.152: LED1.A 5.06,21.91 RN1.1
N$11
  Top 0.152: LED2.A 4.76,20.64 5.15,20.25 RN1.2
N$25
  Top 0.152: LED3.A 4.76,19.37 5.15,19.75 RN1.3
N$26
  Top 0.152: LED4.A 5.06,18.1 RN1.4
NRST  (via drill 0.35)
  Top 0.152: U1.7 14.4,25.83 14.63,26.06 14.63,42.89 v15.24,43.5 | 29.84,54.07 SW2.B 27.3,53.66 C14.1 R4.1 24.03,50.38 v23.18,49.53 | 29.84,54.07 SW2.B' | SV4.6 29.53,47.31 29.84,47.62 29.84,54.07
  Bottom 0.152: v23.18,49.53 21.27,47.62 16.19,47.62 15.56,46.99 15.56,43.81 v15.24,43.5
OSC32_IN
  Top 0.152: U1.3 12.17,27.83 10.16,29.84 10.16,32.07 11.09,33 Q2.2 11.11,33.99 C3.2
OSC32_OUT
  Top 0.152: U1.4 11.75,27.33 9.53,29.55 9.53,32.07 8.59,33 Q2.1 8.59,35.64 C4.2
OSC_IN
  Top 0.152: 6.03,32.38 R3.1 6.77,31.01 10.95,26.83 U1.5 | 6.03,32.38 C1.2 | Q1.2 2.54,33.33 3.48,32.38 6.03,32.38
OSC_OUT
  Top 0.152: R3.2 C2.2 | C2.2 8.99,27.84 10.5,26.33 U1.6 | Q1.1 2.54,27 3.38,27.84 C2.2
PA4/DAC0  (via drill 0.35)
  Top 0.152: U1.20 17.12,20.23 16.78,20.57 v16.78,20.64 | v16.51,26.04 17.78,27.3 20.95,27.3 v21.91,28.26
  Bottom 0.152: v16.78,20.64 16.51,20.91 v16.51,26.04 | SV4.8 24.77,46.04 24.77,29.84 24.23,29.31 22.96,29.31 v21.91,28.26
PA5/DAC1  (via drill 0.35)
  Top 0.152: U1.21 17.62,20.07 v18.01,20.46 | v21.91,27.26 20.68,26.04 v18.01,26.04
  Bottom 0.152: v18.01,20.46 v18.01,26.04 | SV4.7 25.72,45.09 25.72,30.16 24.56,29.01 23.18,29.01 23.1,29.01 22.54,28.45 22.54,27.62 22.18,27.26 v21.91,27.26
PA6  (via drill 0.35)
  Top 0.152: U1.22 18.12,18.12 v18.1,18.1 | v18.1,8.57 v20.64,8.57
  Bottom 0.152: v18.1,18.1 v18.1,8.57 | v20.64,8.57 20.64,5.08 SV3.7
PA11  (via drill 0.35)
  Top 0.152: U1.44 26.5,26.83 26.61,26.95 33.93,26.95 v34.61,27.62 | SV3.22 35.88,5.08 10.98,5.08 10.48,5.58 10.48,10.69 R9.2
  Bottom 0.152: SV3.22 37.15,15.24 34.61,17.78 v34.61,27.62
PA12  (via drill 0.35)
  Top 0.152: R7.1 26.89,14.71 v26.99,14.61 | v26.99,10.48 24.45,7.94 v15.56,7.94 | v31.43,19.37 30.48,18.41 27.62,18.41 26.99,17.78 v26.99,17.46 | U1.45 31.21,27.33 v31.43,27.55 | v10.48,2.54 9.11,3.91 R8.2
  Bottom 0.152: v15.56,7.94 15.52,7.98 13.88,7.98 13.06,7.15 13.06,3.21 12.38,2.54 v10.48,2.54 | v26.99,17.46 v26.99,14.61 v26.99,10.48 | v31.43,27.55 v31.43,19.37
PA13/SWDIO  (via drill 0.35)
  Top 0.152: U1.46 30.69,27.83 31.11,28.26 v32.07,28.26
  Bottom 0.152: SV3.18 v32.07,28.26 SV4.5
PA14/SWCLK  (via drill 0.35)
  Top 0.152: v37.47,30.8 37.39,30.87 24.8,30.87 24.79,30.88 U1.49
  Bottom 0.152: SV3.26 42.23,13.97 37.47,18.73 v37.47,30.8 37.15,31.11 SV4.3
PB1  (via drill 0.35)
  Top 0.152: v24.45,13.34 25.4,12.38 27.62,12.38 28.26,11.75 U3.1 | v21.89,20.85 21.52,20.48 21.19,20.48 20.62,19.91 U1.27
  Bottom 0.152: v24.45,13.34 24.43,13.35 24.43,18.31 24.41,18.33 24.39,18.36 v21.89,20.85
PB10  (via drill 0.35)
  Top 0.152: v22.23,18.1 21.91,18.1 21.62,18.39 U1.29 | J4.3 46.04,11.11 42.55,7.62 25.72,7.62 SV3.12
  Bottom 0.152: v22.23,18.1 23.81,16.51 23.81,7.62 24.45,6.99 SV3.12
PB14  (via drill 0.35)
  Top 0.152: U1.35 27.27,22.33 v27.67,21.94
  Bottom 0.152: SV3.15 28.26,5.08 28.26,21.59 27.91,21.94 v27.67,21.94
PB15  (via drill 0.35)
  Top 0.152: U1.36 28,22.83 v28.89,21.94
  Bottom 0.152: v28.89,21.94 28.91,21.92 28.91,7.6 29.53,6.99 SV3.16
PC0
  Top 0.152: U1.8 10.42,25.33 7.17,22.08 RN1.8
PC2
  Top 0.152: U1.10 10.03,24.33 7.65,21.95 7.65,20.35 7.55,20.25 RN1.7
PC3
  Top 0.152: U1.11 10.18,23.83 8.26,21.91 8.26,20 8.01,19.75 RN1.6
PC8  (via drill 0.35)
  Top 0.152: U1.39 24.25,24.33 23.35,25.23 v23.35,28.4 | v26.32,36.2 v20.32,36.2
  Bottom 0.152: v23.35,28.4 24.91,28.4 26.35,29.84 26.35,36.17 v26.32,36.2 | J5.1 2.86,45.4 5.4,42.86 10.79,42.86 17.46,36.2 v20.32,36.2
PC9  (via drill 0.35)
  Top 0.152: U1.40 24.38,24.83 23.97,25.24 v23.97,27.74 | v26.99,37.15 v21.27,37.15
  Bottom 0.152: v23.97,27.74 25.31,27.74 26.99,29.41 v26.99,37.15 | v21.27,37.15 18.73,37.15 5.4,50.48 J5.2
PC13
  Top 0.152: U1.2 12.89,28.33 12.04,29.18 12.04,40.3 12.06,40.32 12.06,43.79 7.94,47.92 J5.3
PHY_INT  (via drill 0.35)
  Top 0.152: SV1.2 42.86,18.41 41.59,19.68 39.59,19.68 39.3,19.97 27.33,19.97 v27.3,20.01 | v23.72,21.31 23.58,21.45 21.64,21.45 20.12,19.93 U1.26
  Bottom 0.152: v27.3,20.01 25.43,20.01 24.13,21.31 v23.72,21.31
RMII_CRS_DV  (via drill 0.35)
  Top 0.152: SV1.8 43.81,25.72 42.58,24.49 40.87,24.49 40.83,24.45 28.48,24.45 28.44,24.41 27.94,24.41 27.93,24.42 v26.4,24.42 | U1.23 18.62,20.86 21.2,23.44 v21.91,23.44
  Bottom 0.152: v26.4,24.42 22.89,24.42 v21.91,23.44
RMII_REF_CLK  (via drill 0.35)
  Top 0.152: v29.21,26.04 SV1.7 | v21.91,25.4 18.34,21.83 U1.15
  Bottom 0.152: v29.21,26.04 27.94,26.04 27.3,25.4 v21.91,25.4
RMII_RXD0  (via drill 0.35)
  Top 0.152: v29.53,23.81 40.96,23.81 SV1.5 | U1.24 19.12,20.7 21.24,22.83 v22.65,22.83
  Bottom 0.152: v29.53,23.81 23.63,23.81 v22.65,22.83
RMII_RXD1  (via drill 0.35)
  Top 0.152: SV1.6 42.82,22.5 29.61,22.5 v29.52,22.6 | U1.25 19.62,20.46 21.39,22.23 v23.81,22.23
  Bottom 0.152: v23.81,22.23 24.13,22.55 29.14,22.55 29.15,22.54 29.46,22.54 v29.52,22.6
RMII_TX_EN
  Top 0.152: J4.4 48.58,16.19 45.09,19.68 42.55,19.68 SV1.3 41.26,20.95 41.01,20.71 22.61,20.71 22.12,20.21 U1.30
RMII_TXD0
  Top 0.152: SV1.4 42.82,21.95 40.55,21.95 39.61,21.01 26.35,21.01 26.03,21.33 U1.33
RMII_TXD1  (via drill 0.35)
  Top 0.152: U1.34 26.35,21.83 26.85,21.33 29.14,21.33 29.58,21.77 v39.51,21.77
  Bottom 0.152: v39.51,21.77 39.51,20.18 SV1.1
SPI2_MISO  (via drill 0.35)
  Top 0.152: U1.56 19.62,32.63 21.87,34.88 34.25,34.88 v34.29,34.84 | U3.2 v29.53,12.06 | v31.46,13.39 35.82,13.39 v35.88,13.34
  Bottom 0.152: SV3.21 35.88,5.08 v35.88,13.34 35.88,15.13 33.68,17.32 33.68,34.23 v34.29,34.84 | v29.53,12.06 30.86,13.39 v31.46,13.39
SPI2_MOSI  (via drill 0.35)
  Top 0.152: U1.57 19.12,32.77 21.91,35.56 v33.34,35.56 | v33.34,16.51 33.28,16.45 U3.5
  Bottom 0.152: SV3.19 33.34,5.08 v33.34,16.51 v33.34,35.56
SPI2_NSS  (via drill 0.35)
  Top 0.152: U1.50 22.62,31.51 23.78,32.67 v36.51,32.67
  Bottom 0.152: SV3.24 39.37,6.67 39.37,15.56 36.51,18.41 v36.51,32.67
SPI2_SCK  (via drill 0.35)
  Top 0.152: U1.55 20.12,32.5 21.85,34.23 v35.56,34.23 | v38.42,14.92 31.75,14.92 30.8,15.88 U3.6
  Bottom 0.152: SV3.23 38.42,5.08 v38.42,14.92 38.42,15.24 35.56,18.1 v35.56,34.23
UART4_RX  (via drill 0.35)
  Top 0.152: SV4.10 19.37,43.05 22.09,40.32 v22.27,40.32 | U1.54 20.62,31.98 v22.27,33.63
  Bottom 0.152: v22.27,33.63 v22.27,40.32
UART4_TX  (via drill 0.35)
  Top 0.152: U1.53 21.12,31.57 22.54,32.99 v23.18,32.99
  Bottom 0.152: v23.18,32.99 23.18,45.09 SV4.9
USART0_RX  (via drill 0.35)
  Top 0.152: U1.59 18.12,35.19 v18.17,35.24 | v13.65,38.1 13.65,45.72 SV4.12
  Bottom 0.152: v18.17,35.24 16.51,35.24 v13.65,38.1
USART0_TX  (via drill 0.35)
  Top 0.152: U1.58 18.62,33.88 18.78,34.04 18.78,40.26 18.73,40.3 v18.73,40.32
  Bottom 0.152: v18.73,40.32 18.73,44.45 SV4.11
USART2_RX  (via drill 0.35)
  Top 0.152: v20.93,28.44 20.93,29.39 21.62,30.08 U1.52
  Bottom 0.152: SV3.10 21.56,6.7 21.56,10.09 20.93,10.73 v20.93,28.44
USART2_TX  (via drill 0.35)
  Top 0.152: U1.51 22.12,29.38 v21.91,29.17
  Bottom 0.152: SV3.8 19.37,28.16 20.32,29.11 21.86,29.11 v21.91,29.17
USART5_RX  (via drill 0.35)
  Top 0.152: U1.38 24.51,23.83 v23.81,23.13
  Bottom 0.152: SV3.11 23.18,5.08 23.18,15.56 21.29,17.45 21.29,21.1 21.64,21.45 22.13,21.45 v23.81,23.13
USART5_TX  (via drill 0.35)
  Top 0.152: U1.37 25.97,23.33 26.1,23.21 v30.48,23.21 | v30.48,19.37 v25.72,19.37
  Bottom 0.152: SV3.13 26.99,4.13 25.72,5.4 v25.72,19.37 | v30.48,23.21 v30.48,19.37
VBAT  (via drill 0.35)
  Top 0.203: D1.C 12.7,35.24 | 12.7,35.24 12.7,31.01 C15.1 12.91,30.55 12.88,30.51 12.88,30.1 13.52,29.47 U1.1 | 12.7,35.24 v12.7,39.69
  Bottom 0.203: v12.7,39.69 7.94,39.69 J11.2
VBUS
  Top 0.406: J2.1 6.23,13.37 D2.A 6.84,17.71 C16.2

### Text on the board
tNames: PC8 | PC9 | PC13 | TX | RX | GND | 1 | GND | RX_0 | TX_0 | RX_4 | TX_4 | DAC0 | DAC1 | NRST | SWDIO | GND | SWCLK | GND | VBAT+ | GD32F10xRx / GD32F207Rx / GD32F303Rx / GD32F407Rx | GND | www.gd32-dmx.org | VCC | GND | PA2 | PC1 | MDIO | MDC | PA1 | PA7 | REF / CLK | CRS | PC4 | PC5 | RXD0 | RXD1 | PB11 | PB12 | TXEN | TXD0 | PB13 | PB0 | TXD1 | INT | GND | +3V3 | SCL_1 | SDA_1 | x03 / only | TX_2 | RX_2 | +5V | +5V | GND | TX_2 | RX_2 | PB10 | GND | PB15 | PA13 / SWDIO | GND | PA11 | NSS | PA14 / SWCLK | POWER / DFU | +3V3 | SDA | SCL | PA6 | GND | RX_5 | TX_5 | PB14 | +3V3 | MOSI | MISO | SCK | GND